# EAGLE design PCB1_new (EAGLE 8.1.0)
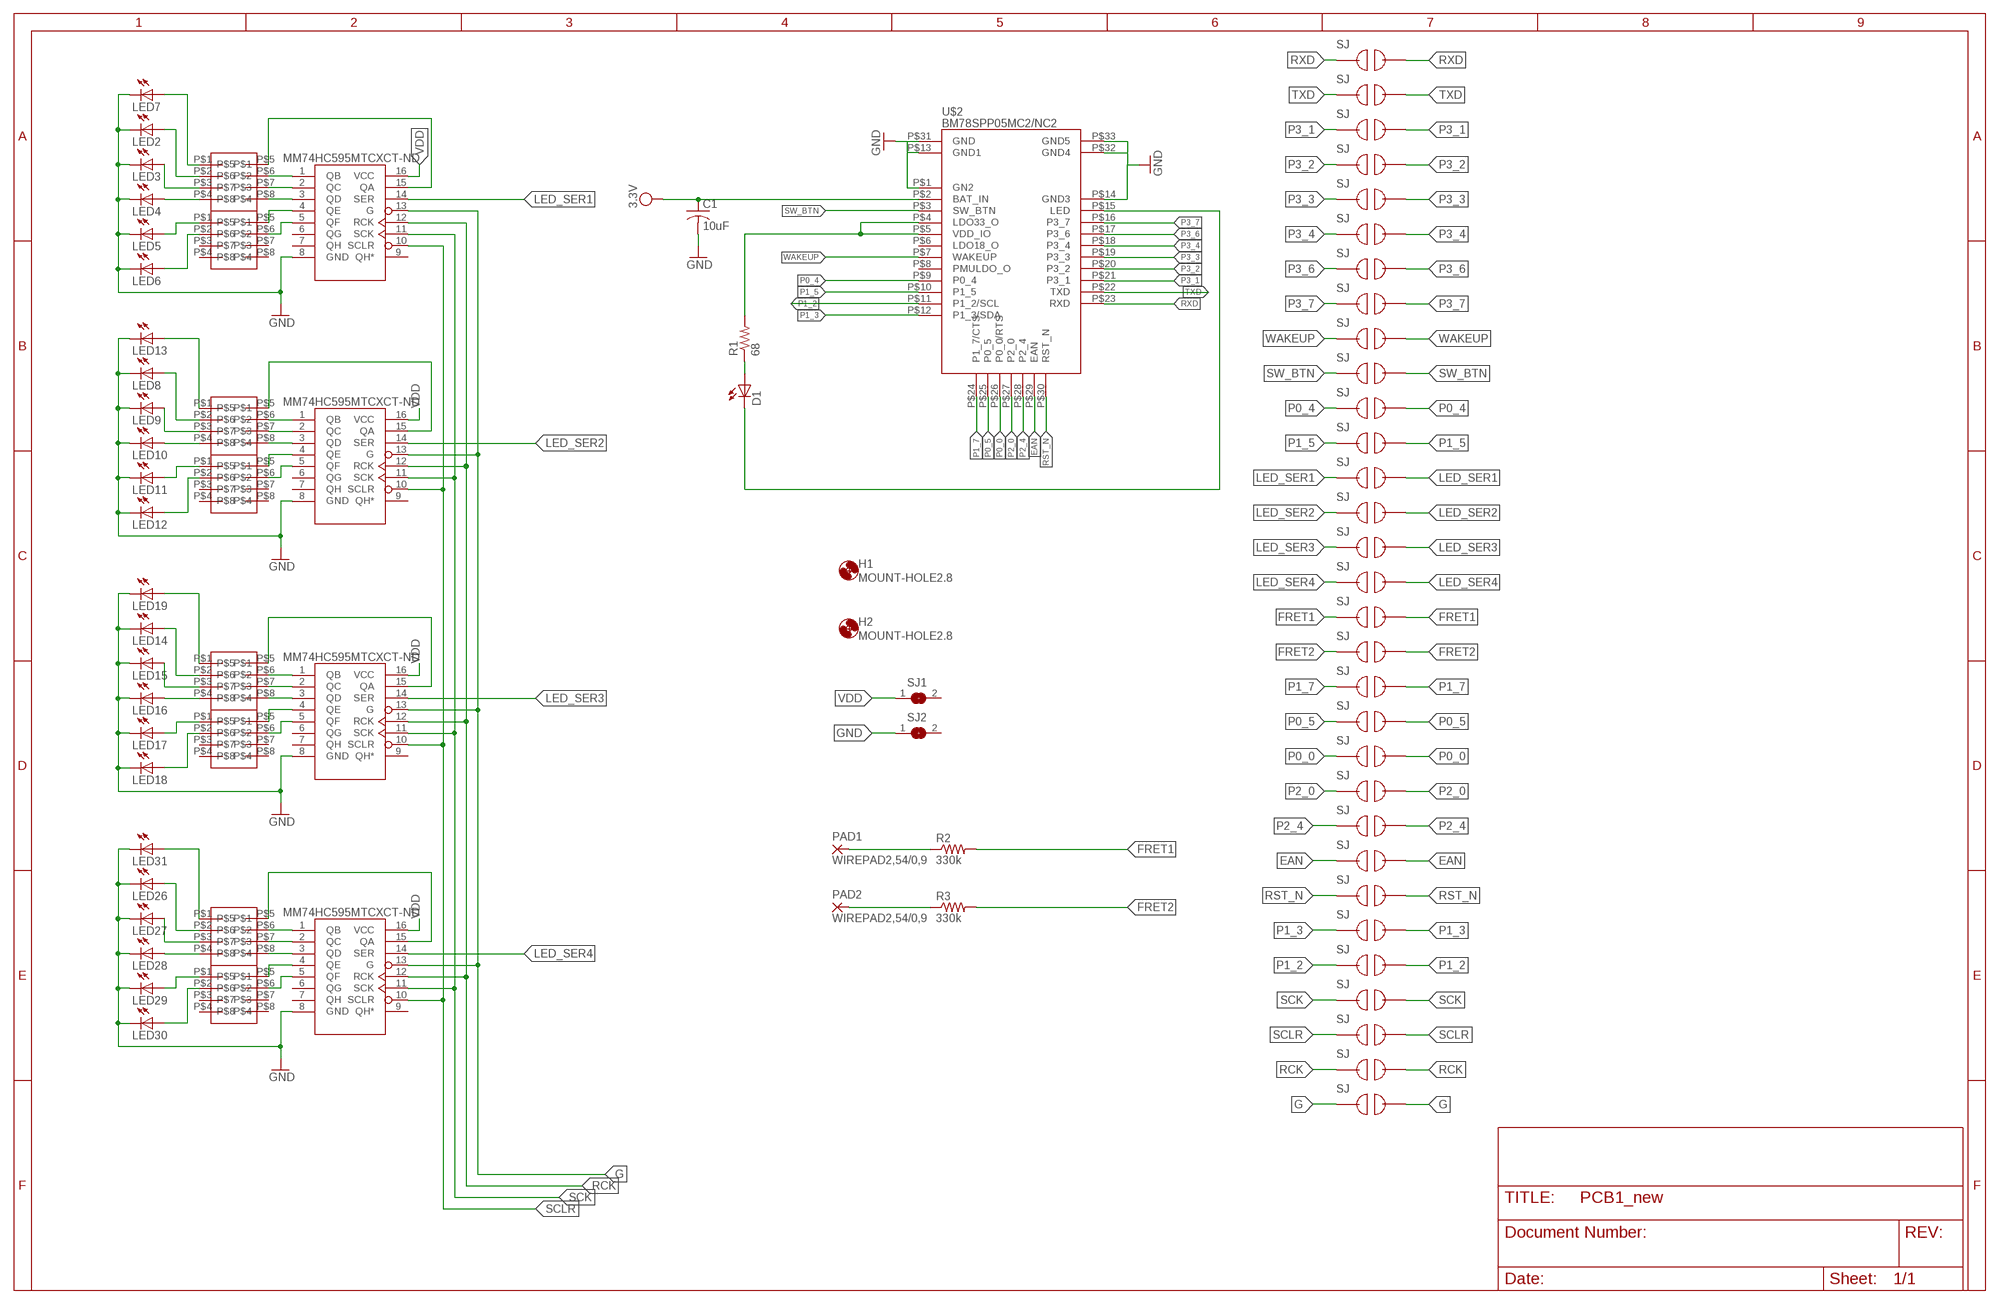
[diagram p0: schematic, sheet 1]

## Parts
C1  10uF  C-USC0805  [C0805]
D1  LEDSMT1206  [1206]
H1  MOUNT-HOLE2.8  [2,8]
H2  MOUNT-HOLE2.8  [2,8]
LED2  LEDSMT1206  [1206]
LED3  LEDSMT1206  [1206]
LED4  LEDSMT1206  [1206]
LED5  LEDSMT1206  [1206]
LED6  LEDSMT1206  [1206]
LED7  LEDSMT1206  [1206]
LED8  LEDSMT1206  [1206]
LED9  LEDSMT1206  [1206]
LED10  LEDSMT1206  [1206]
LED11  LEDSMT1206  [1206]
LED12  LEDSMT1206  [1206]
LED13  LEDSMT1206  [1206]
LED14  LEDSMT1206  [1206]
LED15  LEDSMT1206  [1206]
LED16  LEDSMT1206  [1206]
LED17  LEDSMT1206  [1206]
LED18  LEDSMT1206  [1206]
LED19  LEDSMT1206  [1206]
LED26  LEDSMT1206  [1206]
LED27  LEDSMT1206  [1206]
LED28  LEDSMT1206  [1206]
LED29  LEDSMT1206  [1206]
LED30  LEDSMT1206  [1206]
LED31  LEDSMT1206  [1206]
PAD1  WIREPAD2,54/0,9  [2,54/0,9]
PAD2  WIREPAD2,54/0,9  [2,54/0,9]
R1  68  R-US_M0805  [M0805]
R2  330k  R-US_R0805  [R0805]
R3  330k  R-US_R0805  [R0805]
RN1  MNR04MRAPJ680  [MNR04]
RN2  MNR04MRAPJ680  [MNR04]
SJ1  SJW  [SJW]
SJ2  SJW  [SJW]
U$1  MM74HC595TSSOP-LD16  [MM74HC595MTCXCT-ND]
U$2  BM78SPP05MC2/NC2  [BM78SPP05MC2/NC2]
U$3  MM74HC595TSSOP-LD16  [MM74HC595MTCXCT-ND]
U$4  MM74HC595TSSOP-LD16  [MM74HC595MTCXCT-ND]
U$5  MM74HC595TSSOP-LD16  [MM74HC595MTCXCT-ND]
U$6  JUMPER  [JUMPER]
U$7  JUMPER  [JUMPER]
U$8  JUMPER  [JUMPER]
U$9  JUMPER  [JUMPER]
U$10  JUMPER  [JUMPER]
U$11  JUMPER  [JUMPER]
U$12  JUMPER  [JUMPER]
U$13  JUMPER  [JUMPER]
U$14  JUMPER  [JUMPER]
U$15  JUMPER  [JUMPER]
U$16  JUMPER  [JUMPER]
U$17  JUMPER  [JUMPER]
U$18  JUMPER  [JUMPER]
U$19  JUMPER  [JUMPER]
U$20  JUMPER  [JUMPER]
U$21  JUMPER  [JUMPER]
U$22  JUMPER  [JUMPER]
U$23  JUMPER  [JUMPER]
U$24  JUMPER  [JUMPER]
U$25  JUMPER  [JUMPER]
U$26  JUMPER  [JUMPER]
U$27  JUMPER  [JUMPER]
U$28  JUMPER  [JUMPER]
U$29  JUMPER  [JUMPER]
U$30  JUMPER  [JUMPER]
U$31  JUMPER  [JUMPER]
U$32  JUMPER  [JUMPER]
U$33  JUMPER  [JUMPER]
U$34  JUMPER  [JUMPER]
U$35  JUMPER  [JUMPER]
U$36  JUMPER  [JUMPER]
U$39  MNR04MRAPJ680  [MNR04]
U$40  MNR04MRAPJ680  [MNR04]
U$41  MNR04MRAPJ680  [MNR04]
U$42  MNR04MRAPJ680  [MNR04]
U$43  MNR04MRAPJ680  [MNR04]
U$44  MNR04MRAPJ680  [MNR04]

## Nets
EAN: U$2.P$29(EAN) U$26.P$1 U$26.P$2
FRET1: R2.2 U$19.P$1 U$19.P$2
FRET2: R3.2 U$20.P$1 U$20.P$2
G: U$1.13(G) U$3.13(G) U$4.13(G) U$5.13(G) U$30.P$1 U$30.P$2
GND: C1.2 LED2.C LED3.C LED4.C LED5.C LED6.C LED7.C LED8.C LED9.C LED10.C LED11.C LED12.C LED13.C LED14.C LED15.C LED16.C LED17.C LED18.C LED19.C LED26.C LED27.C LED28.C LED29.C LED30.C LED31.C SJ2.1 U$1.8(GND) U$2.P$1(GN2) U$2.P$13(GND1) U$2.P$14(GND3) U$2.P$31(GND) U$2.P$32(GND4) U$2.P$33(GND5) U$3.8(GND) U$4.8(GND) U$5.8(GND)
LED: D1.C U$2.P$15(LED)
LED_SER1: U$4.14(SER) U$15.P$1 U$15.P$2
LED_SER2: U$1.14(SER) U$16.P$1 U$16.P$2
LED_SER3: U$3.14(SER) U$17.P$1 U$17.P$2
LED_SER4: U$5.14(SER) U$18.P$1 U$18.P$2
N$1: RN1.P$6 U$4.1(QB)
N$2: RN1.P$7 U$4.2(QC)
N$3: RN1.P$8 U$4.3(QD)
N$4: RN2.P$5 U$4.4(QE)
N$5: RN2.P$6 U$4.5(QF)
N$6: LED7.A RN1.P$1
N$7: RN1.P$5 U$4.15(QA)
N$8: LED2.A RN1.P$2
N$9: LED3.A RN1.P$3
N$10: LED4.A RN1.P$4
N$11: LED5.A RN2.P$1
N$12: LED6.A RN2.P$2
N$13: U$1.1(QB) U$39.P$6
N$14: U$1.2(QC) U$39.P$7
N$15: D1.A R1.1
N$16: R1.2 U$2.P$4(LDO33_O) U$2.P$5(VDD_IO)
N$17: LED10.A U$39.P$4
N$18: LED16.A U$41.P$4
N$19: LED28.A U$43.P$4
N$21: U$1.3(QD) U$39.P$8
N$22: U$1.4(QE) U$40.P$5
N$23: U$1.5(QF) U$40.P$6
N$24: U$1.15(QA) U$39.P$5
N$25: LED13.A U$39.P$1
N$26: LED8.A U$39.P$2
N$27: LED9.A U$39.P$3
N$29: LED11.A U$40.P$1
N$30: LED12.A U$40.P$2
N$35: U$3.1(QB) U$41.P$6
N$36: U$3.2(QC) U$41.P$7
N$37: U$3.3(QD) U$41.P$8
N$38: U$3.4(QE) U$42.P$5
N$39: U$3.5(QF) U$42.P$6
N$40: U$3.15(QA) U$41.P$5
N$41: LED19.A U$41.P$1
N$43: LED14.A U$41.P$2
N$44: LED15.A U$41.P$3
N$47: LED17.A U$42.P$1
N$49: LED18.A U$42.P$2
N$60: U$5.1(QB) U$43.P$6
N$61: U$5.2(QC) U$43.P$7
N$62: U$5.3(QD) U$43.P$8
N$63: U$5.4(QE) U$44.P$5
N$64: U$5.5(QF) U$44.P$6
N$66: U$5.15(QA) U$43.P$5
N$67: LED31.A U$43.P$1
N$68: LED26.A U$43.P$2
N$69: LED27.A U$43.P$3
N$71: LED29.A U$44.P$1
N$72: LED30.A U$44.P$2
N$116: PAD1.1(P) R2.1
N$117: PAD2.1(P) R3.1
P0_0: U$2.P$26(P0_0/RTS) U$23.P$1 U$23.P$2
P0_4: U$2.P$9(P0_4) U$13.P$1 U$13.P$2
P0_5: U$2.P$25(P0_5) U$22.P$1 U$22.P$2
P1_2: U$2.P$11(P1_2/SCL) U$29.P$1 U$29.P$2
P1_3: U$2.P$12(P1_3/SDA) U$28.P$1 U$28.P$2
P1_5: U$2.P$10(P1_5) U$14.P$1 U$14.P$2
P1_7: U$2.P$24(P1_7/CTS) U$21.P$1 U$21.P$2
P2_0: U$2.P$27(P2_0) U$24.P$1 U$24.P$2
P2_4: U$2.P$28(P2_4) U$25.P$1 U$25.P$2
P3_1: U$2.P$21(P3_1) U$33.P$1 U$33.P$2
P3_2: U$2.P$20(P3_2) U$6.P$1 U$6.P$2
P3_3: U$2.P$19(P3_3) U$7.P$1 U$7.P$2
P3_4: U$2.P$18(P3_4) U$8.P$1 U$8.P$2
P3_6: U$2.P$17(P3_6) U$9.P$1 U$9.P$2
P3_7: U$2.P$16(P3_7) U$10.P$1 U$10.P$2
RCK: U$1.12(RCK) U$3.12(RCK) U$4.12(RCK) U$5.12(RCK) U$31.P$1 U$31.P$2
RST_N: U$2.P$30(RST_N) U$27.P$1 U$27.P$2
RXD: U$2.P$23(RXD) U$35.P$1 U$35.P$2
SCK: U$1.11(SCK) U$3.11(SCK) U$4.11(SCK) U$5.11(SCK) U$32.P$1 U$32.P$2
SCLR: U$1.10(SCLR) U$3.10(SCLR) U$4.10(SCLR) U$5.10(SCLR) U$36.P$1 U$36.P$2
SW_BTN: U$2.P$3(SW_BTN) U$12.P$1 U$12.P$2
TXD: U$2.P$22(TXD) U$34.P$1 U$34.P$2
VDD: C1.1 SJ1.1 U$1.16(VCC) U$2.P$2(BAT_IN) U$3.16(VCC) U$4.16(VCC) U$5.16(VCC) ; supply symbol labelled 3.3V
WAKEUP: U$2.P$7(WAKEUP) U$11.P$1 U$11.P$2
Unconnected: RN2.P$3 RN2.P$4 RN2.P$7 RN2.P$8 SJ1.2 SJ2.2 U$1.6(QG) U$1.7(QH) U$1.9(QH*) U$2.P$6(LDO18_O) U$2.P$8(PMULDO_O) U$3.6(QG) U$3.7(QH) U$3.9(QH*) U$4.6(QG) U$4.7(QH) U$4.9(QH*) U$5.6(QG) U$5.7(QH) U$5.9(QH*) U$40.P$3 U$40.P$4 U$40.P$7 U$40.P$8 U$42.P$3 U$42.P$4 U$42.P$7 U$42.P$8 U$44.P$3 U$44.P$4 U$44.P$7 U$44.P$8

## Library data of the parts
C1 = rcl:C-US: CAPACITOR, American symbol
D1 LED2-LED19 LED26-LED31 = led:LED: LED OSRAM: - CHIPLED LG R971, LG N971, LY N971, LG Q971, LY Q971, LO R971, LY R971 LH N974, LH R974 LS Q976, LO Q976, LY Q976 LO Q996 - Hyper CHIPLED LW Q18S LB Q993, LB Q99A, LB R99A - SideLED LS A670, LO A670, LY A670, LG A670, LP A670 LB A673, LV A673, LT A673, LW A673 LH A674 LY A675 LS A676, LA A676, LO A676, LY A676, LW A676 LS A679, LY A679, LG A679 - Hyper Micro SIDELED® LS Y876, LA Y876, LO Y876, LY Y876 LT Y87S - SmartLED LW L88C, LW L88S LB L89C, LB L89S, LG L890 LS L89K, LO L89K, LY L89K LS L896, LA L896, LO L896, LY L896 - TOPLED LS T670, LO T670, LY T670, LG T670, LP T670 LSG T670, LSP T670, LSY T670, LOP T670, LYG T670 LG T671, LOG T671, LSG T671 LB T673, LV T673, LT T673, LW T673 LH T674 LS T676, LA T676, LO T676, LY T676, LB T676, LH T676, LSB T676, LW T676 LB T67C, LV T67C, LT T67C, LS T67K, LO T67K, LY T67K, LW E67C LS E67B, LA E67B, LO E67B, LY E67B, LB E67C, LV E67C, LT E67C LW T67C LS T679, LY T679, LG T679 LS T770, LO T770, LY T770, LG T770, LP T770 LB T773, LV T773, LT T773, LW T773 LH T774 LS E675, LA E675, LY E675, LS T675 LS T776, LA T776, LO T776, LY T776, LB T776 LHGB T686 LT T68C, LB T68C - Hyper Mini TOPLED® LB M676 - Mini TOPLED Santana® LG M470 LS M47K, LO M47K, LY M47K Source: http://www.osram.convergy.de LUXEON: - LUMILED® LXK2-PW12-R00, LXK2-PW12-S00, LXK2-PW14-U00, LXK2-PW14-V00 LXK2-PM12-R00, LXK2-PM12-S00, LXK2-PM14-U00 LXK2-PE12-Q00, LXK2-PE12-R00, LXK2-PE12-S00, LXK2-PE14-T00, LXK2-PE14-U00 LXK2-PB12-K00, LXK2-PB12-L00, LXK2-PB12-M00, LXK2-PB14-N00, LXK2-PB14-P00, LXK2-PB14-Q00 LXK2-PR12-L00, LXK2-PR12-M00, LXK2-PR14-Q00, LXK2-PR14-R00 LXK2-PD12-Q00, LXK2-PD12-R00, LXK2-PD12-S00 LXK2-PH12-R00, LXK2-PH12-S00 LXK2-PL12-P00, LXK2-PL12-Q00, LXK2-PL12-R00 Source: www.luxeon.com KINGBRIGHT: KA-3528ASYC Source: www.kingbright.com
H1 H2 = holes:MOUNT-HOLE: MOUNTING HOLE with drill center marker
PAD1 PAD2 = wirepad:WIREPAD: Wire PAD connect wire on PCB
R1-R3 = rcl:R-US_: RESISTOR, American symbol
RN1 RN2 U$39-U$44 = ECE477_Guitutar:MNR04MRAPJ680
SJ1 SJ2 = jumper:SJ: SMD solder JUMPER
U$1 U$3-U$5 = ECE477_Guitutar:MM74HC595
U$2 = ECE477_Guitutar:BM78SPP05MC2/NC2
U$6-U$36 = ECE477_Guitutar:JUMPER

## Board
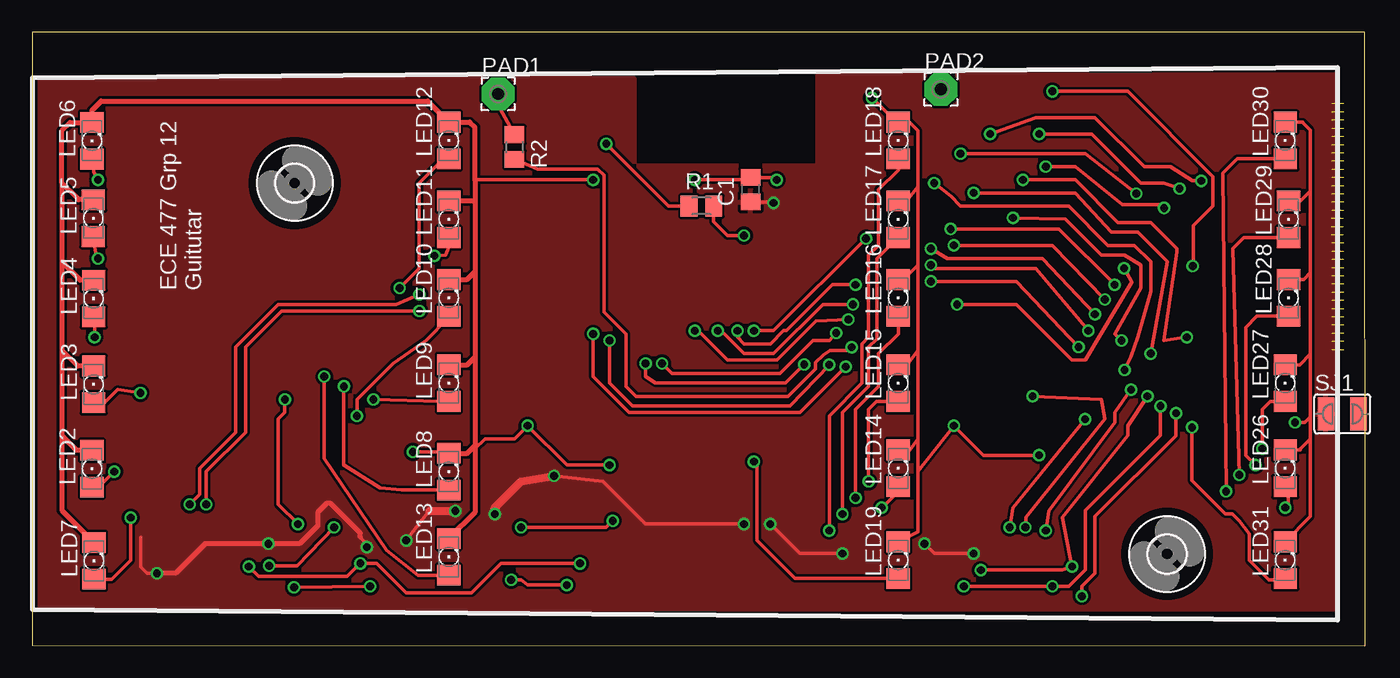
[diagram p1: board, top side]
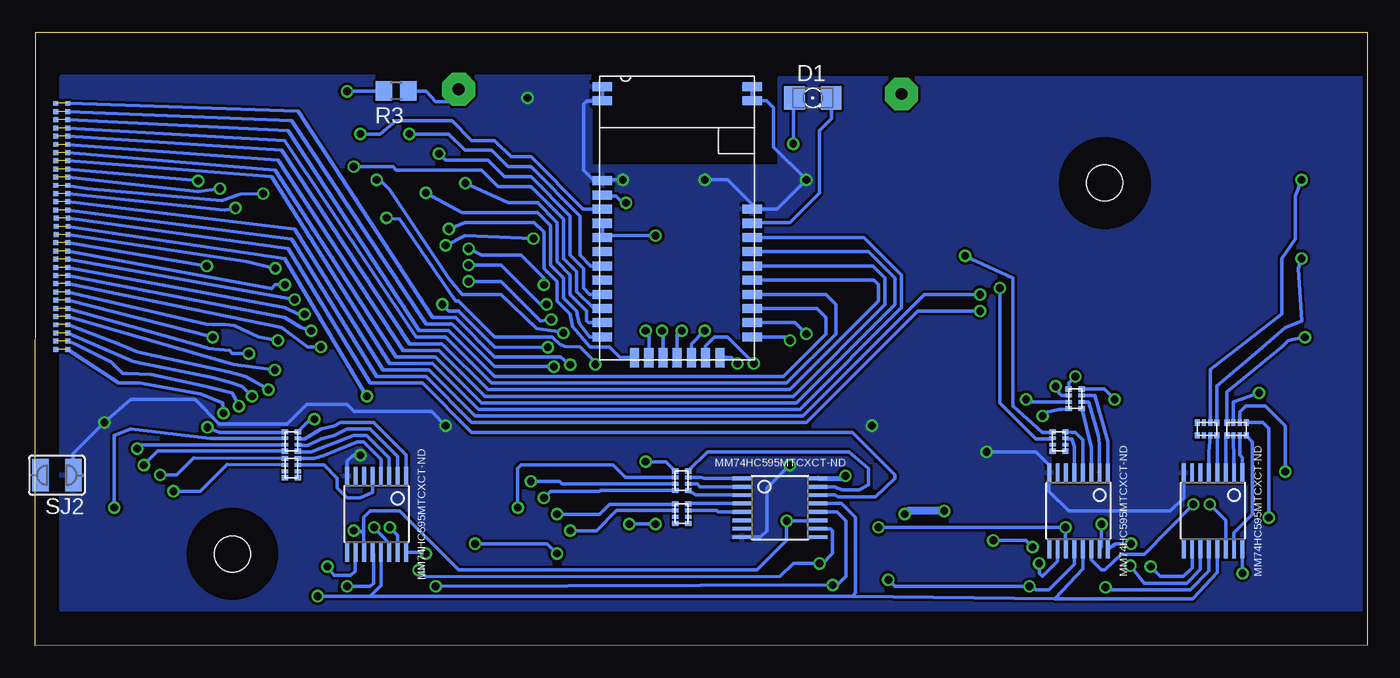
[diagram p2: board, bottom side, seen from below]

Size 103.18 x 47.52 mm. Coordinates in mm from the lower left corner, seen from the top.
Outline: 103.17,0 0,0.03 0,47.51 103.15,47.51
Outline: 103.17,47.52 103.19,0
Copper layers (1*16): Top 0.0356mm / dielectric 1.5011mm / Bottom 0.0356mm
Design rules "ECE_Senior_Design": minimum track width 8mil, minimum drill 13mil, track to track 8mil, track to pad 8mil, pad to pad 6mil, via to via 8mil, smd to smd 6mil, copper to edge 15mil, drill to drill 8mil, minimum pad ring 7mil, minimum via ring 7mil, stop-mask expansion 3mil, vias tented up to drill 0mil, thermal gap 10mil

### Footprints (pad centres in the part's own frame; a part is rotated, then mirrored left to right if it is on the bottom)
C0805 = smd 1.3 x 1.5: 1 -0.95,0; 2 0.95,0
1206 = smd 1.6 x 1.803: A -1.422,0; C 1.422,0
2,8 = hole 2.8: 0,0
2,54/0,9 = drill 0.914 pad 2.54 octagon: 1 0,0
M0805 = smd 1.3 x 1.6: 1 -0.95,0; 2 0.95,0
R0805 = smd 1.3 x 1.5: 1 -0.95,0; 2 0.95,0
MNR04 = smd 0.4 x 0.5: P$1 -0.8,-0.5; P$4 0.7,-0.5; P$5 -0.8,0.5; P$8 0.7,0.5 | smd 0.3 x 0.5: P$2 -0.3,-0.5; P$3 0.2,-0.5; P$6 -0.3,0.5; P$7 0.2,0.5
SJW = smd 1.27 x 2.54: 1 -1.27,0; 2 1.27,0
MM74HC595MTCXCT-ND = smd 0.3 x 1.45: 1 -2.275,-2.95; 2 -1.625,-2.95; 3 -0.975,-2.95; 4 -0.325,-2.95; 5 0.325,-2.95; 6 0.975,-2.95; 7 1.625,-2.95; 8 2.275,-2.95; 9 2.275,2.95; 10 1.625,2.95; 11 0.975,2.95; 12 0.325,2.95; 13 -0.325,2.95; 14 -0.975,2.95; 15 -1.625,2.95; 16 -2.275,2.95
BM78SPP05MC2/NC2 = smd 1.5 x 0.7: P$1 0.2,13.9; P$2 0.2,12.8; P$3 0.2,11.7; P$4 0.2,10.6; P$5 0.2,9.5; P$6 0.2,8.4; P$7 0.2,7.3; P$8 0.2,6.2; P$9 0.2,5.1; P$10 0.2,4; P$11 0.2,2.9; P$12 0.2,1.8; P$13 0.2,20.1; P$14 11.8,11.7; P$15 11.8,10.6; P$16 11.8,9.5; P$17 11.8,8.4; P$18 11.8,7.3; P$19 11.8,6.2; P$20 11.8,5.1; P$21 11.8,4; P$22 11.8,2.9; P$23 11.8,1.8; P$31 0.2,21.2; P$32 11.8,20.1; P$33 11.8,21.2 | smd 0.7 x 1.5: P$24 2.7,0.2; P$25 3.8,0.2; P$26 4.9,0.2; P$27 6,0.2; P$28 7.1,0.2; P$29 8.2,0.2; P$30 9.3,0.2
JUMPER = smd 0.381 x 0.381: P$1 -0.454,0; P$2 0.454,0

### Placement (x,y rotation side)
C1  55.63,35.33 90 top
D1  42.93,42.44 0 bottom
H1  20.32,35.84 0 top
H2  87.88,7.11 0 top
LED2  4.62,13.72 90 top
LED3  4.75,20.24 90 top
LED4  4.75,26.9 90 top
LED5  4.72,33.12 90 top
LED6  4.62,39.12 90 top
LED7  4.78,6.58 90 top
LED8  32.26,13.49 90 top
LED9  32.26,20.35 90 top
LED10  32.26,26.95 90 top
LED11  32.26,33.05 90 top
LED12  32.26,39.14 90 top
LED13  32.26,6.88 90 top
LED14  67.06,13.74 90 top
LED15  67.06,20.35 90 top
LED16  67.06,26.95 90 top
LED17  67.06,33.05 90 top
LED18  67.06,39.14 90 top
LED19  67.06,6.63 90 top
LED26  97.03,13.74 90 top
LED27  97.03,20.35 90 top
LED28  97.28,26.95 90 top
LED29  97.28,33.05 90 top
LED30  97.03,39.14 90 top
LED31  97.03,6.63 90 top
PAD1  36.07,42.75 0 top
PAD2  70.36,43.1 0 top
R1  51.82,34.06 0 top
R2  37.34,38.63 270 top
R3  75.21,42.98 180 bottom
RN1  10.16,16.79 180 bottom
RN2  12.45,16.79 180 bottom
SJ1  101.45,17.96 0 top
SJ2  101.47,13.21 180 bottom
U$1  22.35,10.44 180 bottom
U$2  59.44,22.12 0 bottom
U$3  45.47,10.69 270 bottom
U$4  11.94,10.44 180 bottom
U$5  76.71,10.19 180 bottom
U$6  101.09,40.11 0 bottom
U$7  101.09,39.47 0 bottom
U$8  101.09,38.84 0 bottom
U$9  101.09,38.2 0 bottom
U$10  101.09,37.57 0 bottom
U$11  101.09,36.93 0 bottom
U$12  101.09,36.3 0 bottom
U$13  101.09,35.66 0 bottom
U$14  101.09,35.03 0 bottom
U$15  101.09,34.39 0 bottom
U$16  101.09,33.76 0 bottom
U$17  101.07,33.12 0 bottom
U$18  101.07,32.49 0 bottom
U$19  101.07,31.85 0 bottom
U$20  101.09,31.22 0 bottom
U$21  101.09,30.58 0 bottom
U$22  101.09,29.95 0 bottom
U$23  101.09,29.29 0 bottom
U$24  101.09,28.68 0 bottom
U$25  101.09,28.04 0 bottom
U$26  101.09,27.41 0 bottom
U$27  101.09,26.77 0 bottom
U$28  101.09,26.14 0 bottom
U$29  101.09,25.5 0 bottom
U$30  101.09,22.96 0 bottom
U$31  101.09,23.6 0 bottom
U$32  101.09,24.87 0 bottom
U$33  101.09,40.74 0 bottom
U$34  101.09,41.38 0 bottom
U$35  101.09,42.01 0 bottom
U$36  101.09,24.23 0 bottom
U$39  22.61,19.08 270 bottom
U$40  23.88,15.77 270 bottom
U$41  53.09,12.73 270 bottom
U$42  53.09,10.19 270 bottom
U$43  83.31,15.77 270 bottom
U$44  83.31,13.72 270 bottom

### Tracks (layer width: path | path; a pad name or v marks a point on that pad's centre or on a via)
EAN  (via drill 0.6)  (1 unrouted)
  Top 0.254: v47.5,21.87 47.5,20.85 48.26,20.35 58.33,20.35 v59.77,21.79 | v84.35,23.65 83.82,24.16 85.85,27.71 85.85,29.49 84.58,30.25 82.8,30.25 80.01,33.05 v75.95,33.15
  Bottom 0.254: U$2.P$29 51.24,23.21 50.55,23.9 49.53,23.9 v47.5,21.87 | v59.77,21.79 59.77,21.95 60.96,23.14 62.1,23.16 62.53,23.39 63.12,23.9 67.56,23.9 70.36,26.7 70.61,26.7 74.93,33.05 v75.95,33.15 | v84.35,23.65 85.85,23.9 87.76,24.79 88.44,24.87 89.46,24.87 89.94,24.92 U$26.P$2
FRET1  (via drill 0.6)  (1 unrouted)
  Top 0.254: R2.2 39.11,36.93 43.78,36.93 44.27,36.44 44.27,25.86 45.97,24.16 45.97,20.09 46.74,19.33 58.53,19.33 60.63,21.45 60.66,21.94 61.25,22.53 61.77,22.88 62.48,22.89 63.25,22.89 v63.45,23.11 | v71.63,26.44 76.2,26.44 80.52,22.12 81.53,22.12 85.17,28.17 v84.56,29.24
  Bottom 0.254: v63.45,23.11 67.56,23.14 70.36,25.93 71.12,25.93 v71.63,26.44 | U$19.P$2 86.79,29.77 v84.56,29.24
FRET2  (via drill 0.6)  (1 unrouted)
  Top 0.254: v89.86,29.41 89.92,29.49 89.92,32.54 91.44,34.06 91.44,36.35 84.84,42.95 v78.99,42.95
  Bottom 0.254: v78.99,42.95 76.9,42.95 R3.2 | U$20.P$2 v89.86,29.41
G  (via drill 0.6)  (1 unrouted)
  Top 0.254: v81.28,3.84 81.28,4.6 82.3,5.61 82.3,10.01 88.54,16.26 88.54,17.98 v88.57,18.01
  Bottom 0.254: U$4.13 11.61,5.68 13.49,3.63 24.18,3.63 | U$1.13 22.03,5.94 24.18,3.63 | U$3.13 40.71,11.02 39.62,9.93 39.62,4.09 39.88,3.84 | 24.18,3.63 39.88,3.84 | 39.88,3.84 77.22,3.84 | U$5.13 76.38,4.67 77.22,3.84 | 77.22,3.84 v81.28,3.84 | U$30.P$2 96.67,20.35 95.05,20.35 90.35,19.51 88.65,18.82 v88.57,18.01
GND  (via drill 0.6)
  Top 0.254: 68.58,16.03 68.58,22.89 | 68.58,29.49 68.58,22.89 | 68.58,35.59 68.58,29.49 | 68.58,35.59 68.58,39.9 67.92,40.56 LED18.C 66.9,40.56 v65.02,42.44 | 68.58,16.03 68.58,13.49 | 68.58,13.49 68.58,8.81 LED19.C | LED14.C 67.97,15.16 68.58,16.03 | LED15.C 67.72,21.77 68.58,22.89 | LED16.C 67.46,28.37 68.58,29.49 | LED17.C 67.72,34.47 68.58,35.59 | v57.66,36.09 57.47,36.28 C1.2 55.44,36.09 v51.31,36.09 | v43.43,36.09 34.29,36.09 | v29.46,15.01 32.16,15.01 LED8.C | v44.7,14 41.4,14 v38.35,17.04 37.34,16.03 35.05,16.03 34.29,15.27 | LED30.C 98.4,40.56 98.4,40.54 98.98,39.95 98.98,35.23 | LED26.C 98.2,15.16 98.2,15.24 98.98,16.03 | 97.69,21.77 LED27.C 98.14,21.77 98.98,22.61 | LED28.C 98.45,28.37 98.98,28.91 | 97.94,34.47 LED29.C 98.22,34.47 98.98,35.23 | v97.79,17.3 98.55,17.3 98.98,17.73 | 68.58,13.49 v71.37,17.04 73.66,14.76 v77.98,14.76 | 98.98,35.23 98.98,28.91 | 98.98,22.61 98.98,28.91 | 98.98,22.61 98.98,17.73 | 98.98,16.03 98.98,17.73 | 98.98,16.03 98.98,10.01 LED31.C
  Top 0.406: 2.29,22.89 2.29,16.28 | 2.29,29.74 2.29,22.89 | 2.29,35.84 2.29,29.74 | 2.29,35.84 2.29,39.9 2.92,40.54 LED6.C 4.62,41.48 5.33,42.19 30.63,42.19 LED12.C 33.88,40.56 34.29,40.16 34.29,36.09 34.29,34.32 | 2.29,16.28 2.29,10.49 LED7.C | LED2.C 3.43,15.14 2.29,16.28 | LED3.C 3.51,21.67 2.29,22.89 | LED4.C 3.71,28.32 2.29,29.74 | LED5.C 3.58,34.54 2.29,35.84 | 34.29,22.38 34.29,15.52 | 34.29,28.98 34.29,22.38 | 34.29,34.32 34.29,28.98 | 34.29,15.52 34.29,15.27 34.29,10.34 LED13.C | LED8.C 33.68,14.91 34.29,15.52 | LED9.C 33.68,21.77 34.29,22.38 | LED10.C 33.68,28.37 34.29,28.98 | LED11.C 34.14,34.47 34.29,34.32
  Bottom 0.254: U$4.8 14.21,11.47 15.24,10.44 23.11,10.44 24.64,11.96 U$1.8 24.63,13.98 25.65,15.01 v29.46,15.01 | v57.66,36.09 59.17,36.09 U$2.P$1 59.87,36.02 60.71,36.86 60.71,41.94 60.45,42.19 59.27,42.19 U$2.P$13 U$2.P$31 | U$2.P$33 U$2.P$32 46.52,42.22 45.97,41.68 45.97,38.63 v43.43,36.09 45.7,33.82 U$2.P$14 47.64,34.2 49.53,36.09 v51.31,36.09 | U$3.8 46.98,8.42 46.48,8.92 46.48,12.22 v44.7,14 | 78.98,13.75 U$5.8 78.98,14.31 78.54,14.76 v77.98,14.76 | SJ2.1 100.2,14.88 v97.79,17.3 95.76,19.08 90.78,19.08 88.9,17.2 83.64,17.2 82.14,18.69 78.99,18.69 78.44,18.14 72.47,18.14 v71.37,17.04
  pour Bottom: 0,2.82 101.09,2.82 101.09,44.09 60.2,44.09 60.2,37.11 45.47,37.11 45.47,43.97 0,43.97
LED
  Bottom 0.254: D1.C 41.5,40.82 42.42,39.9 42.42,35.08 44.7,32.79 47.57,32.79 U$2.P$15
LED_SER1  (via drill 0.6)  (1 unrouted)
  Top 0.254: v12.19,10.95 12.95,11.71 12.95,13.74 15.75,16.54 15.75,23.14 19.05,26.44 28.19,26.44 v29.97,27.2
  Bottom 0.254: U$4.14 10.96,9.72 v12.19,10.95 | v29.97,27.2 34.29,27.2 43.69,17.81 69.09,17.81 72.64,21.36 76.2,21.36 83.06,32.28 U$15.P$2
LED_SER2  (via drill 0.6)  (1 unrouted)
  Top 0.254: v13.46,10.95 13.46,13.49 16.51,16.54 16.51,23.14 19.3,25.93 v29.97,25.93
  Bottom 0.254: U$1.14 21.38,6.67 20.57,5.87 20.32,5.87 19.05,7.06 17.27,7.06 v13.46,10.95 | v29.97,25.93 34.8,25.93 43.43,17.3 69.34,17.3 72.9,20.85 76.71,20.85 83.31,31.52 U$16.P$2
LED_SER3  (1 unrouted)
  Bottom 0.254: U$3.14 41.21,11.67 41,11.53 38.1,11.53 36.58,12.98 36.58,13.23 39.88,16.54 69.34,16.54 73.15,20.35 77.22,20.35 83.57,30.76 U$17.P$2
LED_SER4  (via drill 0.6)  (1 unrouted)
  Top 0.254: v76.91,9.17 76.96,9.93 83.06,17.55 82.8,19.08 v77.47,19.33
  Bottom 0.254: U$5.14 75.73,7.94 v76.91,9.17 | U$18.P$2 83.82,30 v77.47,19.33
N$1
  Bottom 0.254: RN1.P$6 9.86,14.76 9.68,14.58 9.68,13.4 U$4.1
N$2
  Bottom 0.254: RN1.P$7 10.31,14.26 U$4.2
N$3
  Bottom 0.254: RN1.P$8 10.96,16.29 U$4.3
N$4
  Bottom 0.254: RN2.P$5 11.61,16.29 U$4.4
N$5
  Bottom 0.254: RN2.P$6 12.26,15.02 U$4.5
N$6  (via drill 0.6)
  Top 0.254: LED7.A 6.15,5.16 7.62,6.63 v7.62,9.93
  Bottom 0.254: RN1.P$1 8.07,17.29 7.62,16.84 v7.62,9.93
N$7
  Bottom 0.254: U$4.15 10.31,8.76 8.89,10.19 8.89,15.78 RN1.P$5
N$8  (via drill 0.6)
  Top 0.254: v6.35,13.49 5.16,12.29 LED2.A
  Bottom 0.254: v6.35,13.49 6.35,17.04 7.87,18.57 9.4,18.57 9.86,18.11 RN1.P$2
N$9  (via drill 0.6)
  Top 0.254: LED3.A 5.59,18.82 6.6,19.84 v8.38,19.58
  Bottom 0.254: RN1.P$3 10.36,18.88 v8.38,19.58
N$10  (via drill 0.6)
  Top 0.254: v4.83,23.9 4.83,25.4 LED4.A
  Bottom 0.254: RN1.P$4 10.86,19.65 6.6,23.14 6.1,23.65 v4.83,23.9
N$11  (via drill 0.6)
  Top 0.254: LED5.A 4.9,30.43 v5.08,30
  Bottom 0.254: RN2.P$1 11.65,20.13 8.38,22.89 6.35,24.66 5.08,25.17 5.33,29.24 v5.08,30
N$12  (via drill 0.6)
  Top 0.254: LED6.A 4.75,36.68 v5.08,36.09
  Bottom 0.254: RN2.P$2 12.15,21.41 6.6,25.68 6.6,30 5.59,31.52 5.59,34.82 v5.08,36.09
N$13
  Bottom 0.254: U$1.1 20.08,15.82 21.09,19.38 U$39.P$6
N$14
  Bottom 0.254: 20.77,13.44 U$1.2 20.73,15.67 20.83,16.28 21.54,18.82 21.6,18.88 U$39.P$7
N$15  (via drill 0.6)
  Top 0.254: v44.45,38.89 49.28,34.06 R1.1
  Bottom 0.254: v44.45,38.89 44.45,42.34 D1.A
N$16  (via drill 0.6)
  Top 0.254: R1.2 52.77,32.86 53.85,31.78 v55.12,31.78
  Bottom 0.254: U$2.P$4 U$2.P$5 59.08,31.78 v55.12,31.78
N$17  (via drill 0.6)
  Top 0.254: v25.15,17.81 25.15,19.08 27.94,21.87 30.48,23.65 32.26,25.43 LED10.A
  Bottom 0.254: U$39.P$4 23.68,18.31 23.88,18.31 24.89,18.06 v25.15,17.81
N$18  (via drill 0.6)
  Top 0.254: LED16.A 67.06,24.16 65.53,22.63 65.53,20.09 63.75,18.31 v63.75,11.46
  Bottom 0.254: v63.75,11.46 63.25,11.96 59.44,11.96 59.37,12.03 U$41.P$4
N$19  (via drill 0.6)
  Top 0.254: LED28.A 94.84,25.53 93.98,24.66 93.98,14.76 v94.74,14
  Bottom 0.254: U$43.P$4 93.66,15.07 v94.74,14
N$21
  Bottom 0.254: U$39.P$8 21.38,15.36 U$1.3
N$22
  Bottom 0.254: U$40.P$5 22.83,16.54 22.61,16.54 22.03,15.96 U$1.4
N$23
  Bottom 0.254: U$40.P$6 23.33,16.03 22.86,16.03 22.68,15.45 U$1.5
N$24  (via drill 0.6)
  Top 0.254: v20.57,9.42 19.05,10.95 19.05,17.55 19.56,18.06 v19.56,19.08
  Bottom 0.254: U$1.15 20.57,7.64 v20.57,9.42 | v19.56,19.08 20.36,19.88 U$39.P$5
N$25  (via drill 0.6)
  Top 0.254: v22.61,20.85 22.61,14.5 27.43,7.39 29.87,5.46 LED13.A
  Bottom 0.254: U$39.P$1 23.11,20.35 v22.61,20.85
N$26  (via drill 0.6)
  Top 0.254: v24.13,20.09 24.13,14 26.92,12.22 28.6,12.07 LED8.A
  Bottom 0.254: v24.13,20.09 23.88,19.58 23.67,19.38 U$39.P$2
N$27  (via drill 0.6)
  Top 0.254: v26.42,19.08 31.6,18.92 LED9.A
  Bottom 0.254: v26.42,19.08 26.22,18.88 U$39.P$3
N$29  (via drill 0.6)
  Top 0.254: LED11.A 32.36,31.12 32,30.25 v31.14,30.2
  Bottom 0.254: U$40.P$1 24.41,16.54 25.15,16.54 27.43,18.57 27.43,28.47 v31.14,30.2
N$30  (via drill 0.6)
  Top 0.254: v28.45,27.71 29.97,29.24 29.97,35.84 31.85,37.72 LED12.A
  Bottom 0.254: U$40.P$2 24.42,16.03 25.65,16.03 28.45,18.82 v28.45,27.71
N$35
  Bottom 0.254: U$3.1 48.43,12.98 51.31,12.98 51.61,13.03 U$41.P$6
N$36
  Bottom 0.254: U$3.2 51.66,12.32 51.87,12.53 U$41.P$7
N$37
  Bottom 0.254: U$41.P$8 51.98,11.67 U$3.3
N$38
  Bottom 0.254: U$42.P$5 52.55,11.02 U$3.4
N$39
  Bottom 0.254: U$42.P$6 50.39,10.49 50.27,10.36 U$3.5
N$40
  Bottom 0.254: U$3.15 41.25,12.32 40.64,12.09 39.37,12.09 38.61,12.47 38.61,13.74 40.13,15.01 51.1,15.01 U$41.P$5
N$41  (via drill 0.6)
  Top 0.254: LED19.A 59.08,5.21 56.13,8.15 56.13,14 v55.88,14.25
  Bottom 0.254: U$41.P$1 54.31,14.25 v55.88,14.25
N$43  (via drill 0.6)
  Top 0.254: LED14.A 67.06,11.96 v65.79,10.69
  Bottom 0.254: v65.79,10.69 65.79,13.74 65.53,14 58.42,14 57.45,13.03 U$41.P$2
N$44  (via drill 0.6)
  Top 0.254: LED15.A 65.38,18.92 64.77,18.31 v64.77,12.73
  Bottom 0.254: U$41.P$3 62.36,12.53 62.56,12.73 v64.77,12.73
N$47  (via drill 0.6)
  Top 0.254: v62.74,10.19 62.74,18.06 64.77,20.09 64.77,23.14 65.41,23.77 65.41,30 65.79,30.38 65.81,30.38 LED17.A
  Bottom 0.254: U$42.P$1 53.88,10.95 58.67,10.95 59.44,10.19 v62.74,10.19
N$49  (via drill 0.6)
  Top 0.254: v61.72,8.92 61.72,17.81 64.26,20.35 64.26,23.39 64.77,23.9 64.77,30.25 65.53,31.01 65.53,35.33 67.06,36.86 LED18.A
  Bottom 0.254: v61.72,8.92 59.69,8.92 58.12,10.49 U$42.P$2
N$60
  Bottom 0.254: U$5.1 74.43,14.77 76.96,17.3 79.5,17.3 80.01,17.04 81.03,16.79 82.3,16.03 82.77,16.03 U$43.P$6
N$61
  Bottom 0.254: U$5.2 75.08,14.66 77.22,16.79 78.99,16.79 80.01,16.28 81.03,16.03 82.04,15.52 82.76,15.52 U$43.P$7
N$62
  Bottom 0.254: U$5.3 75.73,14.54 77.47,16.28 78.49,16.28 81.79,15.01 82.75,15.01 U$43.P$8
N$63
  Bottom 0.254: U$5.4 76.38,14.43 77.72,15.77 78.23,15.77 80.77,14.76 81.53,14.5 82.77,14.5 U$44.P$5
N$64
  Bottom 0.254: U$5.5 77.03,11.89 77.98,11.46 78.99,11.46 79.76,12.22 79.76,12.98 80.77,14 82.77,14 U$44.P$6
N$66  (via drill 0.6)
  Top 0.254: v75.69,9.17 75.95,10.69 v81.53,17.55
  Bottom 0.254: U$5.15 75.08,8.56 v75.69,9.17 | U$43.P$5 82.04,17.34 v81.53,17.55
N$67  (via drill 0.6)
  Top 0.254: LED31.A 96.93,5.11 95.76,5.11 94.23,6.63 94.23,8.66 93.47,9.68 92.94,10.21 92.41,10.21 89.81,12.8 v89.81,16.92
  Bottom 0.254: v89.81,16.92 88.9,16.54 83.85,16.54 U$43.P$1
N$68  (via drill 0.6)
  Top 0.254: LED26.A 97.28,11.46 97.28,10.95 v97.03,10.69
  Bottom 0.254: v97.03,10.69 97.03,16.28 95.76,16.79 89.62,16.07 U$43.P$2
N$69  (via drill 0.6)
  Top 0.254: LED27.A 95.86,18.92 95.25,18.31 v95.25,15.27
  Bottom 0.254: U$43.P$3 94.94,15.57 v95.25,15.27
N$71  (via drill 0.6)
  Top 0.254: LED29.A 93.83,31.62 92.96,30.76 v93.47,13.23
  Bottom 0.254: 83.85,14.5 U$44.P$1 90.89,14.54 92.2,13.23 v93.47,13.23
N$72  (via drill 0.6)
  Top 0.254: LED30.A 93.32,37.72 92.2,36.6 v92.46,11.96
  Bottom 0.254: 83.86,14 U$44.P$2 88.3,14.04 90.37,11.96 v92.46,11.96 92.2,11.96
N$116
  Top 0.254: PAD1.1 36.07,41.87 R2.1
N$117
  Bottom 0.254: R3.1 72.87,42.98 72.14,42.14 70.87,42.14 70.36,43.46 PAD2.1
P0_0  (via drill 0.6)  (1 unrouted)
  Top 0.254: v54.61,24.41 54.61,23.9 55.12,23.39 57.15,23.39 58.17,24.41 58.42,24.41 61.98,27.97 v63.75,27.97 | v82.3,25.68 78.23,30 70.87,30 v69.6,30.76
  Bottom 0.254: U$2.P$26 54.54,24.34 v54.61,24.41 | v63.75,27.97 63.75,28.47 65.53,30.25 68.58,30.25 v69.6,30.76 | v82.3,25.68 82.8,25.68 83.82,26.19 U$23.P$2
P0_4  (via drill 0.6)  (1 unrouted)
  Top 0.254: v85.5,35.03 81.53,38.13 v71.88,38.13
  Bottom 0.254: U$2.P$9 60.22,27.22 60.71,27.71 60.71,29.24 61.72,30.25 61.72,33.3 64.77,36.35 66.8,36.35 68.07,37.62 71.37,37.62 v71.88,38.13 | U$13.P$2 99.14,35.41 88.72,34.49 87.27,35 v85.5,35.03
P0_5  (via drill 0.6)  (1 unrouted)
  Top 0.254: v55.88,24.41 57.4,24.41 v64.57,31.55 | v71.37,31.01 78.99,31.01 v83.06,26.82
  Bottom 0.254: U$2.P$25 55.64,24.17 v55.88,24.41 | v64.57,31.55 69.85,31.78 v71.37,31.01 | v83.06,26.82 U$22.P$2
P1_2  (via drill 0.6)  (1 unrouted)
  Top 0.254: v84.58,21.36 85.09,22.38 85.6,23.9 86.61,27.46 86.61,29.74 85.34,31.01 83.31,31.01 80.26,34.06 71.88,34.06 71.12,34.82 v69.85,35.84
  Bottom 0.254: U$2.P$11 60.3,25.02 60.45,25.17 60.45,25.93 61.72,27.2 61.72,28.73 62.74,29.74 62.74,32.79 64.26,34.32 66.55,34.32 v69.85,35.84 | U$29.P$2 87.78,21.79 v84.58,21.36
P1_3  (via drill 0.6)  (1 unrouted)
  Top 0.254: v86.61,22.63 87.88,29.74 85.6,32.03 83.57,32.03 80.77,35.08 v72.9,35.08
  Bottom 0.254: U$2.P$12 60.22,23.92 61.04,24.99 61.21,25.93 62.23,26.95 62.23,28.47 63.25,29.49 63.25,32.54 64.26,33.55 70.1,33.55 v72.9,35.08 | U$28.P$2 90.73,23.34 89.71,23.04 88.09,22.86 87.88,22.63 v86.61,22.63
P1_5  (via drill 0.6)  (1 unrouted)
  Top 0.254: v78.49,37.11 80.77,37.11 84.4,34.16 87.25,34.16 v87.66,33.91
  Bottom 0.254: U$2.P$10 59.88,26.12 61.21,27.46 61.21,28.98 62.23,30 62.23,33.05 64.77,35.59 67.31,35.59 68.58,36.86 75.18,36.86 75.44,37.11 v78.49,37.11 | U$14.P$2 88.49,33.73 v87.66,33.91
P1_7  (via drill 0.6)  (1 unrouted)
  Top 0.254: v71.12,32.28 79.5,32.28 v83.82,27.97
  Bottom 0.254: U$2.P$24 57.86,22.32 58.67,23.14 60.2,23.14 61.54,24.74 61.72,25.68 62.74,26.7 62.74,28.22 63.75,29.24 63.75,32.03 64.52,32.79 69.85,32.79 v71.12,32.28 | v83.82,27.97 84.58,27.97 84.84,27.69 U$21.P$2
P2_0  (via drill 0.6)  (1 unrouted)
  Top 0.254: v53.09,24.41 53.34,24.41 55.12,22.63 57.4,22.63 61.21,26.44 v63.55,26.44 | v81.79,24.41 77.72,29.24 69.85,29.24 v69.6,29.49
  Bottom 0.254: U$2.P$27 53.44,24.06 v53.09,24.41 | v63.55,26.44 64.01,26.44 67.06,29.49 v69.6,29.49 | v81.79,24.41 82.55,24.66 83.82,25.43 U$24.P$2
P2_4  (via drill 0.6)  (1 unrouted)
  Top 0.254: v51.31,24.41 51.56,24.41 53.85,22.12 57.66,22.12 60.71,25.17 v63.2,25.27 | v69.6,28.22 76.2,28.22 v81.03,23.14
  Bottom 0.254: U$2.P$28 52.34,23.38 v51.31,24.41 | 63.5,25.17 v63.2,25.27 64.01,25.17 67.06,28.22 v69.6,28.22 | v81.03,23.14 82.04,23.14 84.07,24.66 U$25.P$2
P3_1  (1 unrouted)
  Bottom 0.254: U$2.P$21 42.61,26.12 41.91,25.43 41.91,24.16 45.21,20.85 67.56,20.85 71.12,24.41 73.41,24.41 83.57,39.9 U$33.P$2
P3_2  (1 unrouted)
  Bottom 0.254: U$2.P$20 41.93,27.22 41.15,26.44 41.15,24.16 44.96,20.35 67.82,20.35 71.37,23.9 73.66,23.9 83.82,39.14 U$6.P$2
P3_3  (1 unrouted)
  Bottom 0.254: U$2.P$19 38.2,28.32 37.85,27.97 37.85,26.7 44.7,19.84 68.07,19.84 71.63,23.39 74.17,23.39 84.07,38.38 U$7.P$2
P3_4  (1 unrouted)
  Bottom 0.254: U$2.P$18 38.29,29.42 37.34,28.47 37.34,26.44 44.45,19.33 68.33,19.33 71.88,22.89 74.68,22.89 84.33,37.62 U$8.P$2
P3_6  (1 unrouted)
  Bottom 0.254: U$2.P$17 38.63,30.52 36.58,28.47 36.58,26.44 44.2,18.82 68.58,18.82 72.14,22.38 75.18,22.38 84.58,36.86 U$9.P$2
P3_7  (1 unrouted)
  Bottom 0.254: U$2.P$16 38.96,31.62 36.07,28.73 36.07,26.19 43.94,18.31 68.83,18.31 72.39,21.87 75.69,21.87 84.84,36.35 U$10.P$2
RCK  (via drill 0.6)  (1 unrouted)
  Top 0.254: v20.27,4.52 v26.16,4.6 | v37.08,5.11 37.85,5.11 38.35,4.7 v41.4,4.7 | v72.14,4.6 v78.99,4.6 80.26,4.6 81.53,5.87 81.53,10.49 87.35,16.31 87.35,18.54 v87.38,18.57
  Bottom 0.254: U$4.12 12.26,5.8 13.72,4.34 19.81,4.34 v20.27,4.52 | U$1.12 22.68,6.3 24.64,4.34 25.65,4.34 25.91,4.6 v26.16,4.6 36.58,4.6 v37.08,5.11 | U$3.12 41.08,10.37 40.39,9.68 40.39,5.36 41.15,4.6 v41.4,4.7 v72.14,4.6 | v78.99,4.6 77.22,4.6 76.96,4.85 76.96,7.16 U$5.12 | v87.38,18.57 87.88,19.58 89.92,20.09 94.18,21.03 96.01,21.11 96.39,21.11 97.28,22 100.05,23.39 U$31.P$2
RST_N  (via drill 0.6)  (1 unrouted)
  Top 0.254: v48.77,21.87 49.53,21.11 57.91,21.11 60.45,23.65 61.72,23.65 v62.26,24.23 | v76.71,36.09 80.77,36.09 84.07,32.79 86.61,32.79 88.65,30.76 88.65,30.51 87.63,23.65 v89.41,23.9
  Bottom 0.254: U$2.P$30 49.22,22.32 v48.77,21.87 | v62.26,24.23 62.89,24.38 63.25,24.41 64.31,24.56 67.06,27.2 70.1,27.2 71.12,28.47 75.69,35.33 76.2,35.84 v76.71,36.09 | v89.41,23.9 U$27.P$2
RXD  (via drill 0.6)  (1 unrouted)
  Top 0.254: v44.7,23.65 44.7,20.35 46.48,18.57 58.67,18.57 v61.72,21.77
  Bottom 0.254: U$2.P$23 44.98,23.92 v44.7,23.65 | v61.72,21.77 62.48,22.38 67.56,22.38 70.61,25.43 72.39,25.43 82.8,41.43 U$35.P$2
SCK  (via drill 0.6)  (1 unrouted)
  Top 0.254: v18.34,6.2 20.52,6.2 v23.37,9.17 | v37.85,9.17 44.45,9.17 v44.96,9.68 | v78.49,8.92 78.74,10.44 83.82,17.3 83.82,18.06 v85.09,19.84
  Bottom 0.254: U$4.11 12.91,5.91 13.97,4.85 17.27,4.85 v18.34,6.2 | U$1.11 23.37,7.53 v23.37,9.17 v37.85,9.17 | U$3.11 42.56,9.68 v44.96,9.68 44.96,8.15 47.24,5.87 70.36,5.87 74.93,10.44 77.22,10.44 77.72,9.93 77.72,8.66 | 77.72,8.66 77.72,7.28 U$5.11 | v85.09,19.84 86.87,20.85 88.14,21.21 95.22,22.76 96.67,23.37 U$32.P$2 | 77.72,8.66 77.98,8.92 v78.49,8.92
SCLR  (via drill 0.6)  (1 unrouted)
  Top 0.254: v16.76,6.12 17.53,5.36 24.38,5.36 v25.4,6.38 26.67,6.38 28.96,4.09 34.04,4.09 36.32,6.38 v42.42,6.38 | v73.46,5.87 79.76,5.87 v80.52,6.12 79.76,9.93 84.84,16.28 84.84,17.04 v86.36,19.33
  Bottom 0.254: U$4.10 13.56,6.02 14.22,5.36 16,5.36 v16.76,6.12 | U$1.10 23.98,6.53 25.15,5.36 25.4,5.61 v25.4,6.38 | U$5.10 78.36,5.77 78.72,5.46 79.98,5.46 v80.52,6.12 | U$3.10 41.55,9.07 41.4,8.92 41.4,7.14 42.16,6.38 v42.42,6.38 44.45,6.38 45.47,5.36 72.87,5.33 v73.46,5.87 | v86.36,19.33 87.12,20.09 87.88,20.35 89.46,20.78 94.64,21.84 95.58,22.02 U$36.P$2
SW_BTN  (via drill 0.6)  (1 unrouted)
  Top 0.254: v77.98,39.65 82.04,39.65 85.85,35.84 87.63,35.84 88.9,35.41 v88.85,35.41
  Bottom 0.254: U$2.P$3 60.72,33.82 64.77,37.87 66.29,37.87 67.56,39.14 69.34,39.14 70.87,40.67 75.18,40.67 76.45,39.65 v77.98,39.65 | U$12.P$2 90.53,35.18 v88.85,35.41
TXD  (via drill 0.6)  (1 unrouted)
  Top 0.254: v43.43,24.16 43.43,20.85 46.23,18.06 59.44,18.06 v62.99,21.62
  Bottom 0.254: U$2.P$22 44.3,25.02 v43.43,24.16 | v62.99,21.62 67.56,21.62 70.87,24.92 72.9,24.92 83.31,40.67 U$34.P$2
VDD  (via drill 0.6)
  Top 0.254: C1.1 57.34,34.38 v57.4,34.32 | v9.65,5.61 8.89,5.61 8.38,6.12 8.38,8.41 | v72.9,7.14 69.85,7.14 v69.09,7.9 | v62.74,7.14 59.44,7.14 v57.15,9.42 | v55.12,9.42 47.5,9.42 44.2,12.73 v40.41,13.16 | v28.96,8.15 30.73,10.44 | v25.91,7.65 25.91,7.9 25.4,8.41
  Top 0.406: v9.65,5.61 11.1,5.61 13.39,7.9 v18.29,7.9 20.7,7.9 22.1,9.3 22.1,10.34 22.78,11.02 23.11,11.02 25.4,8.74 25.4,8.41
  Top 0.61: 30.73,10.44 v32.77,10.44 | v35.81,10.19 35.81,10.69 37.85,12.73 v40.41,13.16
  Bottom 0.254: v57.4,34.32 57.66,34.32 58.17,34.82 59.14,34.82 U$2.P$2 | U$4.16 9.66,5.62 v9.65,5.61 | U$1.16 19.46,7.9 v18.29,7.9 | 40.63,12.97 v40.41,13.16 | U$5.16 73.5,7.24 v72.9,7.14 | v69.09,7.9 63.5,7.9 v62.74,7.14 | v57.15,9.42 v55.12,9.42 | v28.96,8.15 26.42,8.15 v25.91,7.65
  Bottom 0.406: U$3.16 40.39,12.97 v40.41,13.16
  Bottom 0.61: v32.77,10.44 35.56,10.44 v35.81,10.19
  pour Top: 0,2.82 0,43.97 46.58,43.97 46.58,37.21 60.86,37.21 60.86,44.22 101.02,44.22 101.02,2.82
WAKEUP  (via drill 0.6)  (1 unrouted)
  Top 0.254: v74.17,39.65 77.72,40.92 82.3,40.92 86.11,37.11 88.14,37.11 89.84,36.04 v90.53,36.02
  Bottom 0.254: U$2.P$7 60.13,29.42 60.96,30.25 60.96,33.3 64.77,37.11 66.55,37.11 67.82,38.38 69.85,38.38 71.12,39.65 v74.17,39.65 | U$11.P$2 v90.53,36.02

### Text on the board
tPlace: ECE 477 Grp 12 / Guitutar